# EAGLE design PCB-ENCODER4 (EAGLE 7.5.0)
SKAARHOJ 2012 Rotary Encoder Breakout Board
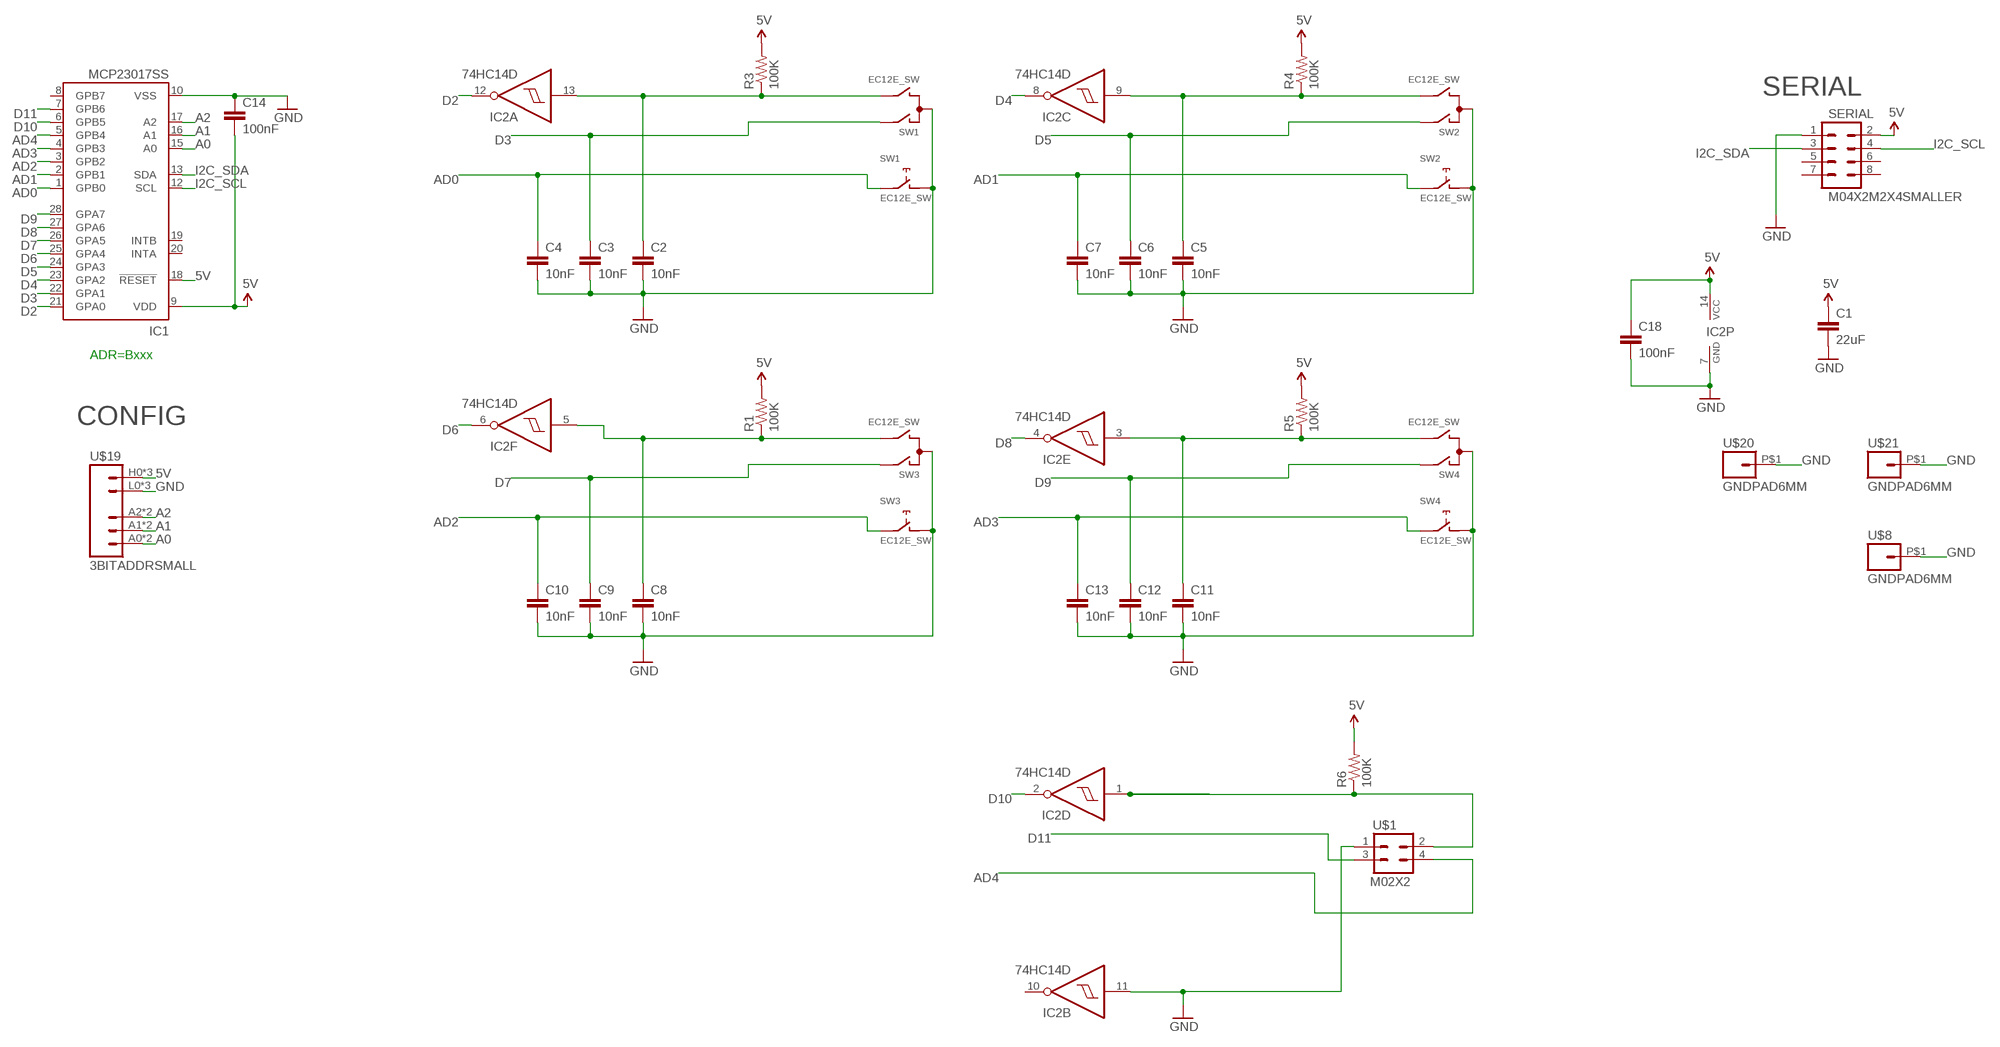
[diagram p0: schematic, sheet 1]

## Parts
C1  22uF  CAP0805  [0805]
C2  10nF  CAP0603-CAP  [0603-CAP]
C3  10nF  CAP0603-CAP  [0603-CAP]
C4  10nF  CAP0603-CAP  [0603-CAP]
C5  10nF  CAP0603-CAP  [0603-CAP]
C6  10nF  CAP0603-CAP  [0603-CAP]
C7  10nF  CAP0603-CAP  [0603-CAP]
C8  10nF  CAP0603-CAP  [0603-CAP]
C9  10nF  CAP0603-CAP  [0603-CAP]
C10  10nF  CAP0603-CAP  [0603-CAP]
C11  10nF  CAP0603-CAP  [0603-CAP]
C12  10nF  CAP0603-CAP  [0603-CAP]
C13  10nF  CAP0603-CAP  [0603-CAP]
C14  100nF  CAP0603-CAP  [0603-CAP]
C18  100nF  CAP0603-CAP  [0603-CAP]
IC1  MCP23017SS  [SSOP28]
IC2  74HC14D  [SO14]
R1  100K  RESISTOR0603-RES  [0603-RES]
R3  100K  RESISTOR0603-RES  [0603-RES]
R4  100K  RESISTOR0603-RES  [0603-RES]
R5  100K  RESISTOR0603-RES  [0603-RES]
R6  100K  RESISTOR0603-RES  [0603-RES]
SERIAL  M04X2M2X4SMALLER  [M2X4SMALLER]
SW1  EC12E_SW  [ALPS_EC12E_SW]
SW2  EC12E_SW  [ALPS_EC12E_SW]
SW3  EC12E_SW  [ALPS_EC12E_SW]
SW4  EC12E_SW  [ALPS_EC12E_SW]
U$1  M02X2  [2X2]
U$8  GNDPAD6MM  [3.2MMPAD6MM]
U$19  3BITADDRSMALL  [3BITADDR_SMALL]
U$20  GNDPAD6MM  [3.2MMPAD6MM]
U$21  GNDPAD6MM  [3.2MMPAD6MM]

## Nets
5V [Power]: C1.1 C14.2 C18.1 IC1.9(VDD) IC1.18(!RESET) IC2.14(P:VCC) R1.2 R3.2 R4.2 R5.2 R6.2 SERIAL.2 U$19.H0(VCC) U$19.H1(VCC) U$19.H2(VCC)
A0: IC1.15(A0) U$19.A0 U$19.AS0(A0)
A1: IC1.16(A1) U$19.A1 U$19.AS1(A1)
A2: IC1.17(A2) U$19.A2 U$19.AS2(A2)
AD0: C4.1 IC1.1(GPB0) SW1.E
AD1: C7.1 IC1.2(GPB1) SW2.E
AD2: C10.1 IC1.3(GPB2) SW3.E
AD3: C13.1 IC1.4(GPB3) SW4.E
AD4: IC1.5(GPB4) U$1.4
D2: IC1.21(GPA0) IC2.12(A:O)
D3: C3.1 IC1.22(GPA1) SW1.A
D4: IC1.23(GPA2) IC2.8(C:O)
D5: C6.1 IC1.24(GPA3) SW2.A
D6: IC1.25(GPA4) IC2.6(F:O)
D7: C9.1 IC1.26(GPA5) SW3.A
D8: IC1.27(GPA6) IC2.4(E:O)
D9: C12.1 IC1.28(GPA7) SW4.A
D10: IC1.6(GPB5) IC2.2(D:O)
D11: IC1.7(GPB6) U$1.3
GND [Power]: C1.2 C2.2 C3.2 C4.2 C5.2 C6.2 C7.2 C8.2 C9.2 C10.2 C11.2 C12.2 C13.2 C14.1 C18.2 IC1.10(VSS) IC2.7(P:GND) IC2.11(B:I) SERIAL.1 SW1.C SW1.D SW2.C SW2.D SW3.C SW3.D SW4.C SW4.D U$1.1 U$8.P$1 U$19.L0(GND) U$19.L1(GND) U$19.L2(GND) U$20.P$1 U$21.P$1
I2C_SCL: IC1.12(SCL) SERIAL.4
I2C_SDA: IC1.13(SDA) SERIAL.3
N$2: IC2.1(D:I) R6.1 U$1.2
N$123: C8.1 IC2.5(F:I) R1.1 SW3.B
N$124: C2.1 IC2.13(A:I) R3.1 SW1.B
N$125: C5.1 IC2.9(C:I) R4.1 SW2.B
N$126: C11.1 IC2.3(E:I) R5.1 SW4.B
Unconnected: IC1.8(GPB7) IC1.19(INTB) IC1.20(INTA) IC2.10(B:O) SERIAL.5 SERIAL.6 SERIAL.7 SERIAL.8 SW1.GND1(G) SW1.GND2(G) SW2.GND1(G) SW2.GND2(G) SW3.GND1(G) SW3.GND2(G) SW4.GND1(G) SW4.GND2(G)

## Notes on the sheet
- SERIAL
- ADR=Bxxx
- CONFIG

## Library data of the parts
C1-C14 C18 = SparkFun:CAP: Capacitor Standard 0603 ceramic capacitor, and 0.1" leaded capacitor.
IC1 = microchip:MCP23017: http://ww1.microchip.com/downloads/en/DeviceDoc/21952a.pdf Source: http://ww1.microchip.com/downloads/en/DeviceDoc/21952a.pdf; MF: MICROCHIP; MPN: MCP23017-E/SS; OC_FARNELL: 1467674; OC_NEWARK: 31K2960
IC2 = 74xx-eu:74*14: Hex schmitt trigger INVERTER
R1 R3-R6 = SparkFun:RESISTOR: Resistor Basic schematic elements and footprints for 0603, 1206, and PTH resistors.
SERIAL = SKAARHOJ:M04X2
SW1-SW4 = switch-alps:EC12E_SW: ALPS rotary Encoder EC12E series with switch; MPN: EC12E2424407; OC_FARNELL: 1520813; OC_NEWARK: 74M1068
U$1 = SKAARHOJ:M02X2
U$8 U$20 U$21 = SKAARHOJ:GNDPAD
U$19 = SKAARHOJ:3BITADDR

## Net classes
0 default: width 0.203 mm, drill 0.406 mm, clearance 0.203 mm
1 Power: width 0.254 mm, drill 0.406 mm, clearance 0.254 mm

## Board
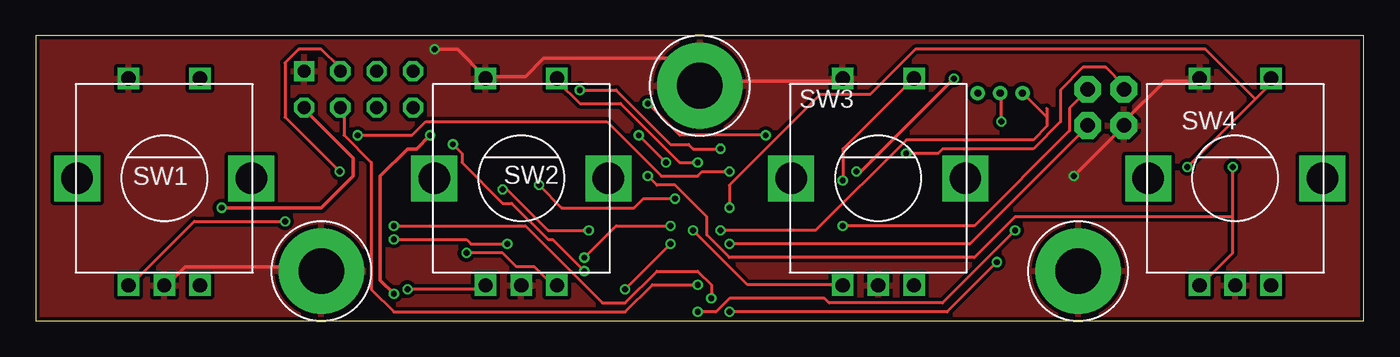
[diagram p1: board, top side]
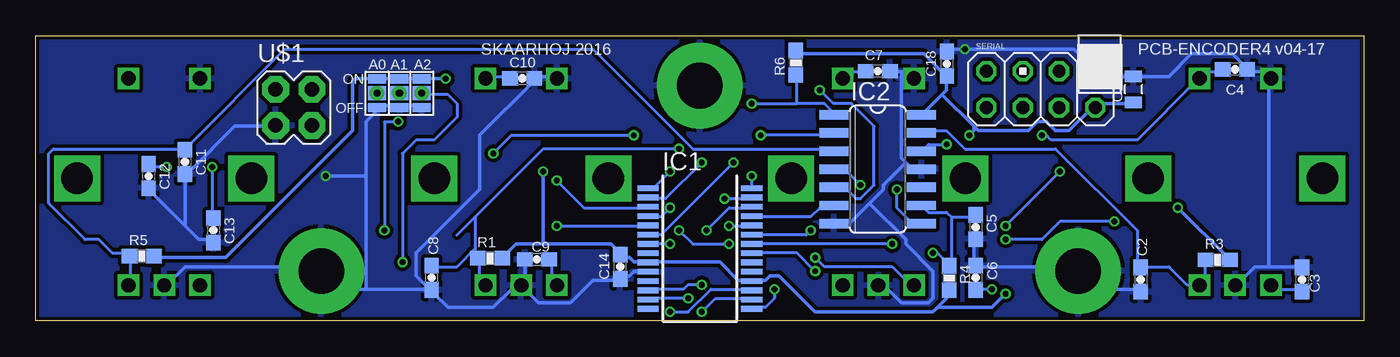
[diagram p2: board, bottom side, seen from below]

Size 93 x 20 mm. Coordinates in mm from the lower left corner, seen from the top.
Outline: 0,0 93,0 93,20 0,20 0,0
Copper layers (1*16): Top 0.035mm / dielectric 1.5mm / Bottom 0.035mm
Design rules "Fusion_eagle_rule_v1.1": minimum track width 6mil, minimum drill 12mil, track to track 6mil, track to pad 6mil, pad to pad 6mil, via to via 6mil, smd to smd 0mil, copper to edge 10mil, drill to drill 10mil, minimum pad ring 10mil, minimum via ring 6mil, stop-mask expansion 2mil, vias tented up to drill 100mil, thermal gap 10mil

### Footprints (pad centres in the part's own frame; a part is rotated, then mirrored left to right if it is on the bottom)
0805 = smd 0.8 x 1.2: 1 -0.9,0; 2 0.9,0
0603-CAP = smd 1.1 x 1: 1 -0.85,0; 2 0.85,0
SSOP28 = smd 0.4 x 1.5: 1 -4.225,-3.625; 2 -3.575,-3.625; 3 -2.925,-3.625; 4 -2.275,-3.625; 5 -1.625,-3.625; 6 -0.975,-3.625; 7 -0.325,-3.625; 8 0.325,-3.625; 9 0.975,-3.625; 10 1.625,-3.625; 11 2.275,-3.625; 12 2.925,-3.625; 13 3.575,-3.625; 14 4.225,-3.625; 15 4.225,3.625; 16 3.575,3.625; 17 2.925,3.625; 18 2.275,3.625; 19 1.625,3.625; 20 0.975,3.625; 21 0.325,3.625; 22 -0.325,3.625; 23 -0.975,3.625; 24 -1.625,3.625; 25 -2.275,3.625; 26 -2.925,3.625; 27 -3.575,3.625; 28 -4.225,3.625
SO14 = smd 0.66 x 2.032: 1 -3.81,-3.073; 2 -2.54,-3.073; 3 -1.27,-3.073; 4 0,-3.073; 5 1.27,-3.073; 6 2.54,-3.073; 7 3.81,-3.073; 8 3.81,3.073; 9 2.54,3.073; 10 1.27,3.073; 11 0,3.073; 12 -1.27,3.073; 13 -2.54,3.073; 14 -3.81,3.073
0603-RES = smd 1.1 x 1: 1 -0.85,0; 2 0.85,0
M2X4SMALLER = drill 0.9 square: 1 -1.27,3.81 | drill 0.9 octagon: 2 1.27,3.81; 3 -1.27,1.27; 4 1.27,1.27; 5 -1.27,-1.27; 6 1.27,-1.27; 7 -1.27,-3.81; 8 1.27,-3.81
ALPS_EC12E_SW = drill 1 square: A -2.5,-7.5; B 2.5,-7.5; C 0,-7.5; D -2.5,7; E 2.5,7 | drill 2.2 square: GND1 -6.1,0; GND2 6.1,0
2X2 = drill 1.016 pad 1.88 octagon: 1 -3.81,-1.27; 2 -3.81,1.27; 3 -1.27,-1.27; 4 -1.27,1.27
3.2MMPAD6MM = drill 3.2 pad 6: P$1 0,0
3BITADDR_SMALL = drill 0.5: A0 -1.565,0; A1 0,0; A2 1.565,0 | smd 1.27 x 1: AS0 -1.565,0; AS1 0,0; AS2 1.565,0 | smd 1.27 x 0.635: H0 -1.565,1; H1 0,1; H2 1.565,1; L0 -1.565,-1; L1 0,-1; L2 1.565,-1

### Placement (x,y rotation side)
C1  16.13,16.24 90 bottom
C2  15.62,2.9 270 bottom
C3  4.32,2.9 90 bottom
C4  9.02,17.64 0 bottom
C5  27.18,6.59 270 bottom
C6  27.18,3.03 90 bottom
C7  34.04,17.51 0 bottom
C8  65.28,3.03 270 bottom
C9  57.9,4.32 180 bottom
C10  58.93,17 0 bottom
C11  82.55,11.16 270 bottom
C12  85.09,10.16 270 bottom
C13  80.55,6.35 270 bottom
C14  52.07,3.81 90 bottom
C18  29.19,18.03 90 bottom
IC1  46.5,5.08 270 bottom
IC2  34.04,10.64 270 bottom
R1  61.18,4.4 0 bottom
R3  10.24,4.29 0 bottom
R4  29.03,3.02 270 bottom
R5  85.57,4.54 0 bottom
R6  39.78,18.1 90 bottom
SERIAL  22.61,16.24 270 bottom
SW1  9,10 0 top
SW2  34,10 0 top
SW3  59,10 0 top
SW4  84,10 0 top
U$1  72.39,14.97 0 bottom
U$8  46.5,16.5 0 top
U$19  67.53,15.97 0 bottom
U$20  20,3.5 0 top
U$21  73,3.5 0 top

### Tracks (layer width: path | path; a pad name or v marks a point on that pad's centre or on a via)
5V  (via drill 0.41)
  Top 0.254: v13.02,7.94 20,7.94 22.23,10.16 22.23,11.43 18.73,14.92 SERIAL.2 | v27.62,13.02 26.67,12.06 26.04,12.06 24.13,10.16 24.13,2.86 v25.08,1.91 | v64.29,16.99 57.78,10.48 v57.47,10.48
  Bottom 0.254: 29.21,17.14 29.21,16.19 29.53,15.88 | 29.53,15.88 30.8,14.61 IC2.14 | 29.21,17.14 30.8,18.73 39.69,18.73 R6.2 | 29.21,17.14 C18.1 | v13.02,7.94 9.53,4.45 R3.2 | C1.1 16.19,15.24 18.73,15.24 SERIAL.2 19.05,14.92 20.64,13.34 21.59,13.34 22.23,13.97 22.86,13.97 23.5,13.34 26.99,13.34 27.3,13.65 | 27.3,13.65 29.53,15.88 | R5.2 84.45,4.45 79.69,4.45 70.8,13.34 70.8,16.83 70.64,16.99 69.22,16.99 U$19.H0 69.06,16.99 67.63,16.99 U$19.H1 67.47,16.99 66.04,16.99 U$19.H2 65.88,16.99 v64.29,16.99 | 57.47,5.4 52.7,5.4 52.07,4.76 C14.2 52.07,4.45 51.44,4.45 51.12,4.13 50.16,4.13 IC1.9 49.85,4.13 45.09,4.13 43.81,2.86 43.18,2.86 IC1.18 42.86,2.86 41.91,2.86 41.59,3.17 40.96,3.17 38.42,0.64 30.16,0.64 29.84,0.95 | 57.47,5.4 59.37,5.4 60.33,4.45 R1.2 | 29.84,0.95 29.21,1.59 29.21,1.91 R4.2 | 57.47,5.4 v57.47,10.48 | 27.3,13.65 27.3,13.34 v27.62,13.02 | v25.08,1.91 26.04,0.95 29.84,0.95
A0  (via drill 0.41)
  Top 0.203: v44.45,5.4 v41.27,2.22 | v47.94,6.35 54.61,6.35 60.96,12.7 69.85,12.7 70.8,13.65 70.8,14.29 | 70.8,14.92 70.8,14.29 | 70.8,14.29 69.22,15.88 U$19.AS0
  Bottom 0.203: v41.27,2.22 41.27,1.59 41.91,0.95 42.86,0.95 IC1.15 | v44.45,5.4 46.99,5.4 v47.94,6.35 | 69.22,16.03 U$19.AS0
A1  (via drill 0.41)
  Top 0.203: v46.35,0.64 47.62,0.64 48.58,1.59 55.24,1.59 55.56,1.27 63.5,1.27 v68.58,6.35 | v67.63,13.97 67.63,15.88 U$19.AS1
  Bottom 0.203: v46.35,0.64 45.4,1.59 43.18,1.59 IC1.16 | v68.58,6.35 68.58,13.97 v67.63,13.97 | 67.63,16.03 U$19.AS1
A2  (via drill 0.41)
  Top 0.203: v48.58,0.64 63.82,0.64 v67.31,4.13
  Bottom 0.203: v48.58,0.64 47.31,0.64 45.72,2.22 43.18,2.22 IC1.17 | v67.31,4.13 67.31,11.75 66.36,12.7 65.09,12.7 63.5,14.29 63.5,15.24 64.14,15.88 65.88,15.88 U$19.AS2 66.04,16.03
AD0  (via drill 0.41)
  Top 0.203: v48.58,10.48 46.67,10.48 46.35,10.16 43.81,10.16 40.01,13.97 27.3,13.97 26.35,13.02 v22.54,13.02
  Bottom 0.203: C4.1 10.16,17.46 11.11,17.46 11.43,17.14 SW1.E 11.75,16.83 15.88,12.7 21.91,12.7 22.23,13.02 v22.54,13.02 | v48.58,10.48 49.85,9.21 IC1.1
AD1  (via drill 0.41)
  Top 0.203: v46.35,11.11 45.09,11.11 40.96,15.24 38.1,15.24 36.51,16.83 SW2.E
  Bottom 0.203: C7.1 34.92,17.46 35.88,17.46 36.2,17.14 SW2.E | v46.35,11.11 48.9,8.57 49.85,8.57 IC1.2
AD2  (via drill 0.41)
  Top 0.203: v56.52,9.84 56.52,12.06 61.28,16.83 SW3.E
  Bottom 0.203: C10.1 60.01,17.14 61.28,17.14 SW3.E | v56.52,9.84 54.61,7.94 50.16,7.94 IC1.3
AD3  (via drill 0.41)
  Top 0.203: 85.41,15.56 86.68,16.83 SW4.E | 85.41,15.56 v80.64,10.79 | v48.58,7.94 48.58,9.53 54.93,15.88 58.42,15.88 61.59,19.05 81.92,19.05 85.41,15.56
  Bottom 0.203: v80.64,10.79 80.64,7.3 C13.1 | v48.58,7.94 49.21,7.3 49.85,7.3 IC1.4
AD4  (via drill 0.41)
  Top 0.203: v56.52,6.67 65.72,6.67 72.39,13.34 72.39,14.92 73.66,16.19 U$1.4
  Bottom 0.203: v56.52,6.67 50.16,6.67 IC1.5
D2  (via drill 0.41)
  Top 0.203: v38.42,3.49 36.2,5.71 35.88,5.71 33.34,8.26 32.7,8.26 29.84,11.11 29.84,11.75 v29.21,12.38
  Bottom 0.203: v38.42,3.49 39.69,4.76 42.86,4.76 IC1.21 | v29.21,12.38 30.48,12.38 30.8,12.06 IC2.12
D3  (via drill 0.41)
  Top 0.203: v33.02,5.4 30.48,5.4 30.16,5.71 v25.08,5.71 | v17.46,6.99 11.11,6.99 6.67,2.54 SW1.A
  Bottom 0.203: C3.1 4.45,2.22 6.35,2.22 SW1.A | v33.02,5.4 42.86,5.4 IC1.22 | v25.08,5.71 22.54,5.71 21.27,6.99 v17.46,6.99
D4  (via drill 0.41)
  Top 0.203: v38.73,6.35 35.88,6.35 33.02,9.21 v32.7,9.21
  Bottom 0.203: v38.73,6.35 39.05,6.03 42.86,6.03 IC1.23 | v32.7,9.21 32.7,7.94 31.75,6.99 31.11,6.99 IC2.8
D5  (via drill 0.41)
  Top 0.203: v26.04,2.22 31.43,2.22 SW2.A | v44.45,6.67 40.64,6.67 v38.42,4.45
  Bottom 0.203: v26.04,2.22 26.99,2.22 C6.1 | v44.45,6.67 43.18,6.67 IC1.24 | v38.42,4.45 37.78,3.81 33.02,3.81 31.75,2.54 SW2.A
D6
  Bottom 0.203: IC1.25 42.86,7.3 38.73,7.3 38.1,7.94 37.15,7.94 IC2.6
D7  (via drill 0.41)
  Top 0.203: v46.04,6.35 49.85,2.54 56.2,2.54 SW3.A
  Bottom 0.203: C9.1 56.83,4.13 56.83,2.86 56.52,2.54 SW3.A | v46.04,6.35 44.45,7.94 43.18,7.94 IC1.26
D8  (via drill 0.41)
  Top 0.203: v44.77,8.57 42.55,8.57 41.91,7.94 36.83,7.94 v35.24,9.53
  Bottom 0.203: v44.77,8.57 43.18,8.57 IC1.27 | v35.24,9.53 36.2,10.48 36.83,10.48 IC2.4
D9  (via drill 0.41)
  Top 0.203: 83.82,7.3 83.82,4.76 81.6,2.54 SW4.A | 83.82,7.3 v83.82,10.79 | v42.86,10.16 43.5,9.53 44.77,9.53 46.99,7.3 46.99,6.03 48.58,4.45 65.72,4.45 68.58,7.3 83.82,7.3
  Bottom 0.203: v83.82,10.79 85.09,10.79 C12.1 | v42.86,10.16 42.86,9.21 IC1.28
D10  (via drill 0.41)
  Top 0.203: v42.23,13.02 v44.13,11.11
  Bottom 0.203: v44.13,11.11 49.21,6.03 49.85,6.03 IC1.6 | v42.23,13.02 37.15,13.02 IC2.2
D11  (via drill 0.41)
  Top 0.203: v48.58,5.4 65.41,5.4 73.66,13.65 U$1.3
  Bottom 0.203: v48.58,5.4 49.85,5.4 IC1.7
GND  (via drill 0.41)
  Top 0.254: SW4.D 81.28,16.83 79.06,16.83 76.2,13.97 U$1.1 76.2,13.65 v72.71,10.16 | U$20.P$1 19.68,3.81 10.48,3.81 9.21,2.54 SW1.C | SW3.D 56.2,16.83 46.99,16.83 46.67,16.51 U$8.P$1 46.35,16.51 44.45,18.41 35.56,18.41 34.29,17.14 31.75,17.14 SW2.D 31.43,17.14 29.53,19.05 v27.94,19.05
  Bottom 0.254: 82.55,6.67 85.09,9.21 C12.2 | 82.55,6.67 81.6,5.71 80.64,5.71 C13.2 | 82.55,6.67 C11.2 82.55,10.48 82.23,10.48 79.06,13.65 76.2,13.65 U$1.1 | IC1.10 50.16,3.49 51.12,3.49 51.44,3.17 52.07,3.17 C14.1 52.07,2.86 53.98,2.86 55.56,1.27 57.78,1.27 58.74,2.22 SW3.C | C9.2 58.74,4.13 58.74,2.54 SW3.C | 69.85,2.22 71.44,2.22 72.71,3.49 U$21.P$1 73.03,3.81 82.55,3.81 83.82,2.54 SW4.C | 69.85,2.22 65.41,2.22 | 69.85,2.22 69.85,10.16 | 69.85,10.16 69.85,13.97 69.22,14.61 69.22,14.92 U$19.L0 69.06,15.08 67.63,15.08 U$19.L1 67.47,15.08 66.04,15.08 U$19.L2 | SW3.C 59.05,2.22 59.69,2.22 60.96,0.95 64.14,0.95 65.09,1.91 C8.2 65.41,2.22 | 69.85,10.16 v72.71,10.16 | C5.2 27.3,5.71 27.3,4.13 C6.2 26.99,3.81 20,3.81 U$20.P$1 19.68,3.49 18.41,2.22 15.88,2.22 C2.2 | C18.2 28.89,19.05 v27.94,19.05 20.32,19.05 19.05,17.78 SERIAL.1 18.73,17.46 18.41,17.14 16.19,17.14 C1.2 15.88,17.14 13.65,17.14 12.06,18.73 9.21,18.73 8.26,17.78 C4.2 7.94,17.46 6.99,17.46 6.67,17.14 SW1.D 6.67,16.83 6.67,3.81 | 6.67,3.81 7.62,3.81 8.89,2.54 SW1.C | 6.67,3.81 4.45,3.81 C3.2 | 37.15,6.99 IC2.7 36.83,6.99 35.88,6.99 34.61,8.26 | 32.38,17.46 32.07,17.46 31.75,17.14 SW2.D | 32.38,17.46 33.02,17.46 C7.2 | 32.07,11.11 32.38,11.43 32.38,17.46 | 32.07,11.11 31.75,10.79 31.11,10.79 IC2.11 | 34.61,8.26 33.66,9.21 33.66,9.53 32.07,11.11 | 34.61,8.26 32.07,5.71 32.07,5.4 30.16,3.49 30.16,1.59 30.48,1.27 32.38,1.27 33.34,2.22 33.97,2.22 SW2.C | SW3.D 56.52,17.14 57.78,17.14 C10.2 58.1,16.83 61.91,13.02 61.91,9.21 66.36,4.76 66.36,3.17 65.41,2.22
  pour Top: 0,0 93,0 93,20 0,20
  pour Bottom: 0,0 93,0 93,20 0,20
I2C_SCL  (via drill 0.41)
  Top 0.203: v46.35,2.54 43.18,2.54 41.27,0.64 25.08,0.64 23.5,2.22 23.5,11.11 21.59,13.02 21.59,14.92 SERIAL.4
  Bottom 0.203: v46.35,2.54 47.31,2.54 47.62,2.22 49.85,2.22 IC1.12
I2C_SDA  (via drill 0.41)
  Top 0.203: v47.31,1.59 47.31,2.54 46.35,3.49 43.5,3.49 41.27,1.27 39.69,1.27 34.29,6.67 v25.08,6.67 | v21.27,10.48 17.46,14.29 17.46,18.1 18.41,19.05 20,19.05 21.27,17.78 SERIAL.3
  Bottom 0.203: v47.31,1.59 49.85,1.59 IC1.13 | v21.27,10.48 v25.08,6.67
N$2  (via drill 0.41)
  Top 0.203: v42.86,15.24 45.09,13.02 v51.12,13.02 | v60.96,11.75 63.18,11.75 63.5,12.06 69.85,12.06 71.75,13.97 71.75,16.19 73.34,17.78 74.93,17.78 76.2,16.51 U$1.2
  Bottom 0.203: 39.69,15.24 37.78,15.24 37.15,14.61 IC2.1 | 39.69,15.24 39.69,17.14 R6.1 | v42.86,15.24 39.69,15.24 | v51.12,13.02 59.69,13.02 v60.96,11.75
N$123  (via drill 0.41)
  Top 0.203: v47.94,12.06 46.04,12.06 45.72,12.38 44.45,12.38 40.64,16.19 v38.1,16.19
  Bottom 0.203: C8.1 65.09,3.81 63.5,3.81 62.23,5.08 | 62.23,7.3 57.47,12.06 v47.94,12.06 | 62.23,7.3 63.5,6.03 | v38.1,16.19 37.15,15.24 35.88,15.24 34.29,13.65 34.29,9.53 35.24,8.57 35.56,8.57 36.2,9.21 36.83,9.21 IC2.5 | 62.23,7.3 62.23,5.08 | 62.23,5.08 62.23,4.45 R1.1 61.91,4.13 61.91,2.86 61.59,2.54 SW3.B
N$124
  Bottom 0.203: IC2.13 30.8,13.34 29.21,13.34 27.94,12.06 21.59,12.06 15.88,6.35 15.88,3.81 C2.1 15.56,3.81 13.65,3.81 12.38,2.54 11.75,2.54 SW1.B 11.43,2.54 11.11,2.86 11.11,4.13 R3.1
N$125  (via drill 0.41)
  Top 0.203: v30.16,4.76 32.7,4.76 33.66,3.81 34.92,3.81 36.2,2.54 SW2.B
  Bottom 0.203: 28.89,7.3 27.3,7.3 C5.1 | IC2.9 30.8,7.94 30.48,7.62 29.21,7.62 28.89,7.3 | 28.89,7.3 28.89,4.13 R4.1 29.21,4.13 29.84,4.76 v30.16,4.76
N$126
  Bottom 0.203: 82.55,12.06 91.76,12.06 92.08,11.75 92.08,8.26 89.53,5.71 88.58,5.71 87.63,4.76 86.68,4.76 R5.1 86.36,4.45 86.36,2.54 SW4.B | 82.55,12.06 75.56,19.05 53.98,19.05 46.99,12.06 37.15,12.06 IC2.3 | 82.55,12.06 C11.1

### Text on the board
_bsilk: PCB-ENCODER4 v04-17 | SKAARHOJ 2016